# EAGLE design AIOT_02 (EAGLE 9.2.2)
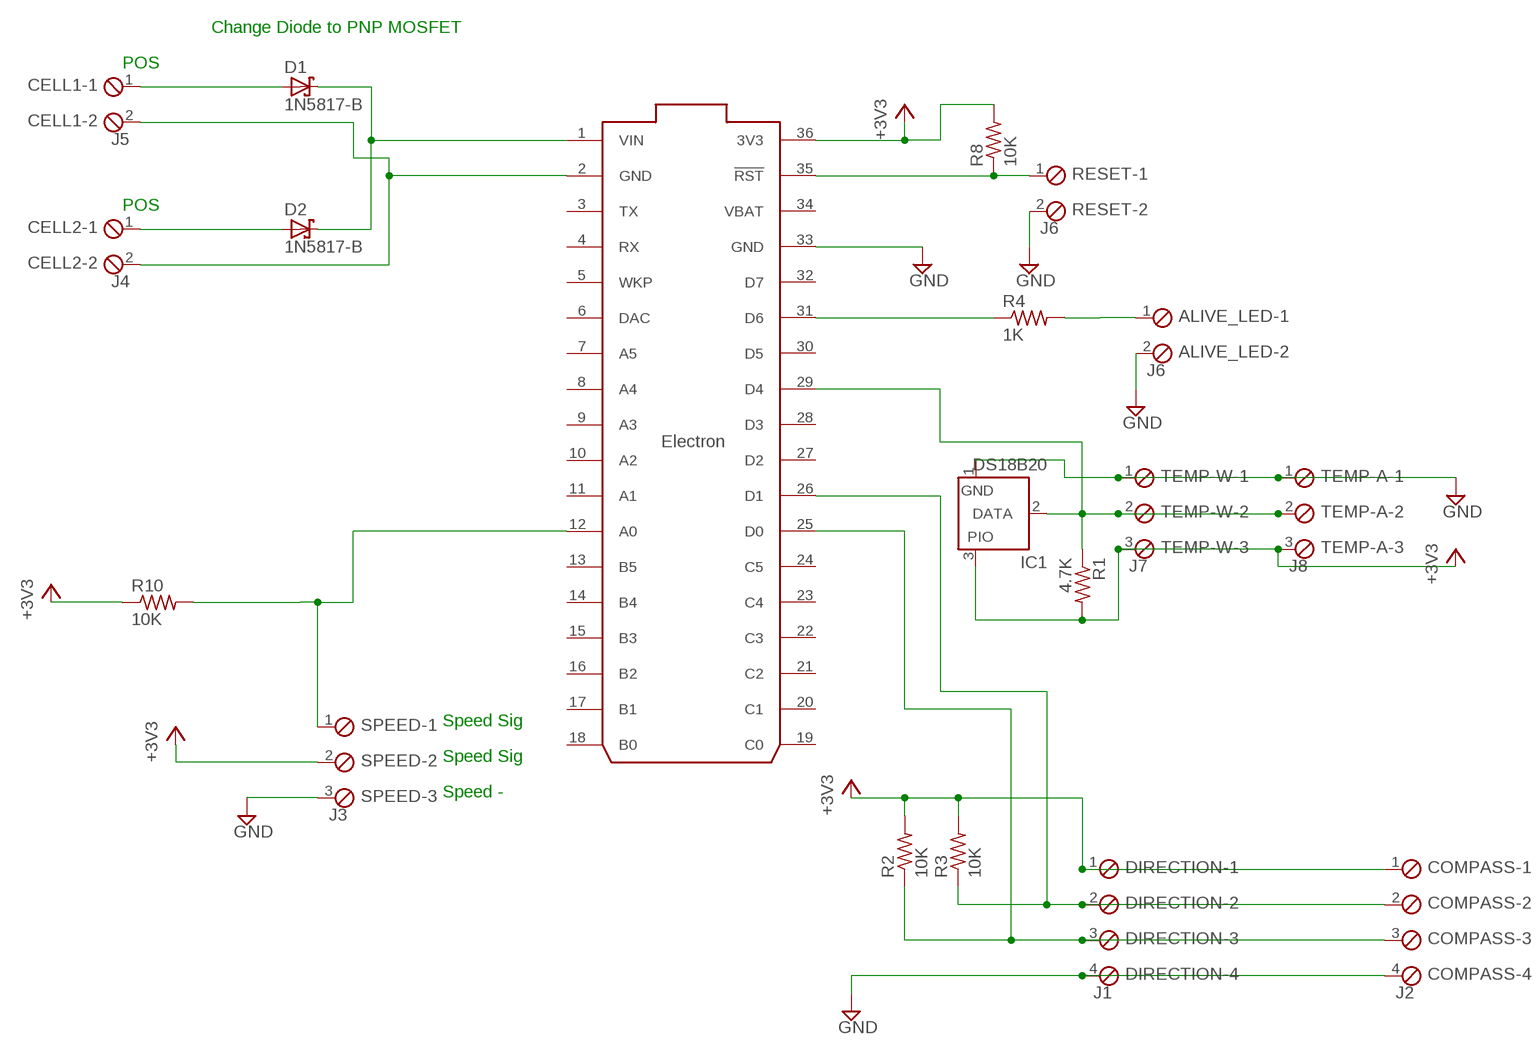
[diagram p0: schematic, sheet 1]

## Parts
ALIVE_LED  J6  MPT2  [2POL254]
CELL1  J5  MPT2  [2POL254]
CELL2  J4  MPT2  [2POL254]
COMPASS  J2  MPT4  [4POL254]
D1  1N5817-B  [DO41-7.6]
D2  1N5817-B  [DO41-7.6]
DIRECTION  J1  MPT4  [4POL254]
IC1  DS18B20  DS2405  [TO92-]
R1  4.7K  R-US_R1210  [R1210]
R2  10K  R-US_R1210  [R1210]
R3  10K  R-US_R1210  [R1210]
R4  1K  R-US_R1210  [R1210]
R8  10K  R-US_R1210  [R1210]
R10  10K  R-US_R1210  [R1210]
RESET  J6  MPT2  [2POL254]
SPEED  J3  MPT3  [3POL254]
TEMP-A  J8  MPT3  [3POL254]
TEMP-W  J7  MPT3  [3POL254]
U$1  ELECTRON_WITH_HEADERS  [ELECTRON]

## Nets
+3V3: COMPASS.1 DIRECTION.1 IC1.3(PIO) R1.2 R2.2 R3.2 R8.2 R10.1 SPEED.2 TEMP-A.3 TEMP-W.3 U$1.36(3V3)
GND: ALIVE_LED.2 CELL1.2 CELL2.2 COMPASS.4 DIRECTION.4 IC1.1(GND) RESET.2 SPEED.3 TEMP-A.1 TEMP-W.1 U$1.2(GND) U$1.33(GND)
N$1: CELL1.1 D1.A
N$2: D1.C D2.C U$1.1(VIN)
N$3: CELL2.1 D2.A
N$5: R10.2 SPEED.1 U$1.12(A0)
N$6: COMPASS.2 DIRECTION.2 R3.1 U$1.26(D1)
N$7: ALIVE_LED.1 R4.2
N$8: COMPASS.3 DIRECTION.3 R2.1 U$1.25(D0)
N$9: IC1.2(DATA) R1.1 TEMP-A.2 TEMP-W.2 U$1.29(D4)
N$10: R8.1 RESET.1 U$1.35(!RST)
N$11: R4.1 U$1.31(D6)
Unconnected: U$1.3(TX) U$1.4(RX) U$1.5(WKP) U$1.6(DAC) U$1.7(A5) U$1.8(A4) U$1.9(A3) U$1.10(A2) U$1.11(A1) U$1.13(B5) U$1.14(B4) U$1.15(B3) U$1.16(B2) U$1.17(B1) U$1.18(B0) U$1.19(C0) U$1.20(C1) U$1.21(C2) U$1.22(C3) U$1.23(C4) U$1.24(C5) U$1.27(D2) U$1.28(D3) U$1.30(D5) U$1.32(D7)

## Notes on the sheet
- Change Diode to PNP MOSFET
- POS
- POS
- Speed Sig
- Speed Sig
- Speed -

## Power pins joined to a net without a drawn wire
VBAT: U$1.34(VBAT)

## Library data of the parts
ALIVE_LED CELL1 CELL2 RESET = con-phoenix-254:MPT2: PHOENIX CONNECTOR
COMPASS DIRECTION = con-phoenix-254:MPT4: PHOENIX CONNECTOR
D1 D2 = diode:1N581*: 1.0A SCHOTTKY BARRIER RECTIFIER Source: http://www.diodes.com/datasheets/ds23001.pdf
IC1 = maxim:DS2405: Addressable Switch DALLAS Semiconductor; MF: DALLAS SEMICONDUCTOR; MPN: DS2405; OC_FARNELL: 1188025; OC_NEWARK: 06F4645
R1-R4 R8 R10 = rcl:R-US_: RESISTOR, American symbol; SPICEPREFIX: R
SPEED TEMP-A TEMP-W = con-phoenix-254:MPT3: PHOENIX CONNECTOR
U$1 = Particle-Devices:ELECTRON: The Particle Electron is a tiny development kit for creating cellular-connected electronics projects and products. It comes with a SIM card (Nano 4FF) and an affordable data plan for low-bandwidth things. Design files : here <https://github.com/particle-iot/electron> Product Page : Datasheet <https://docs.particle.io/datasheets/electron-(cellular)/electron-datasheet/> Github : Particle devices library <https://github.com/particle-iot/hardware-libraries/tree/master/Eagle>

## Board
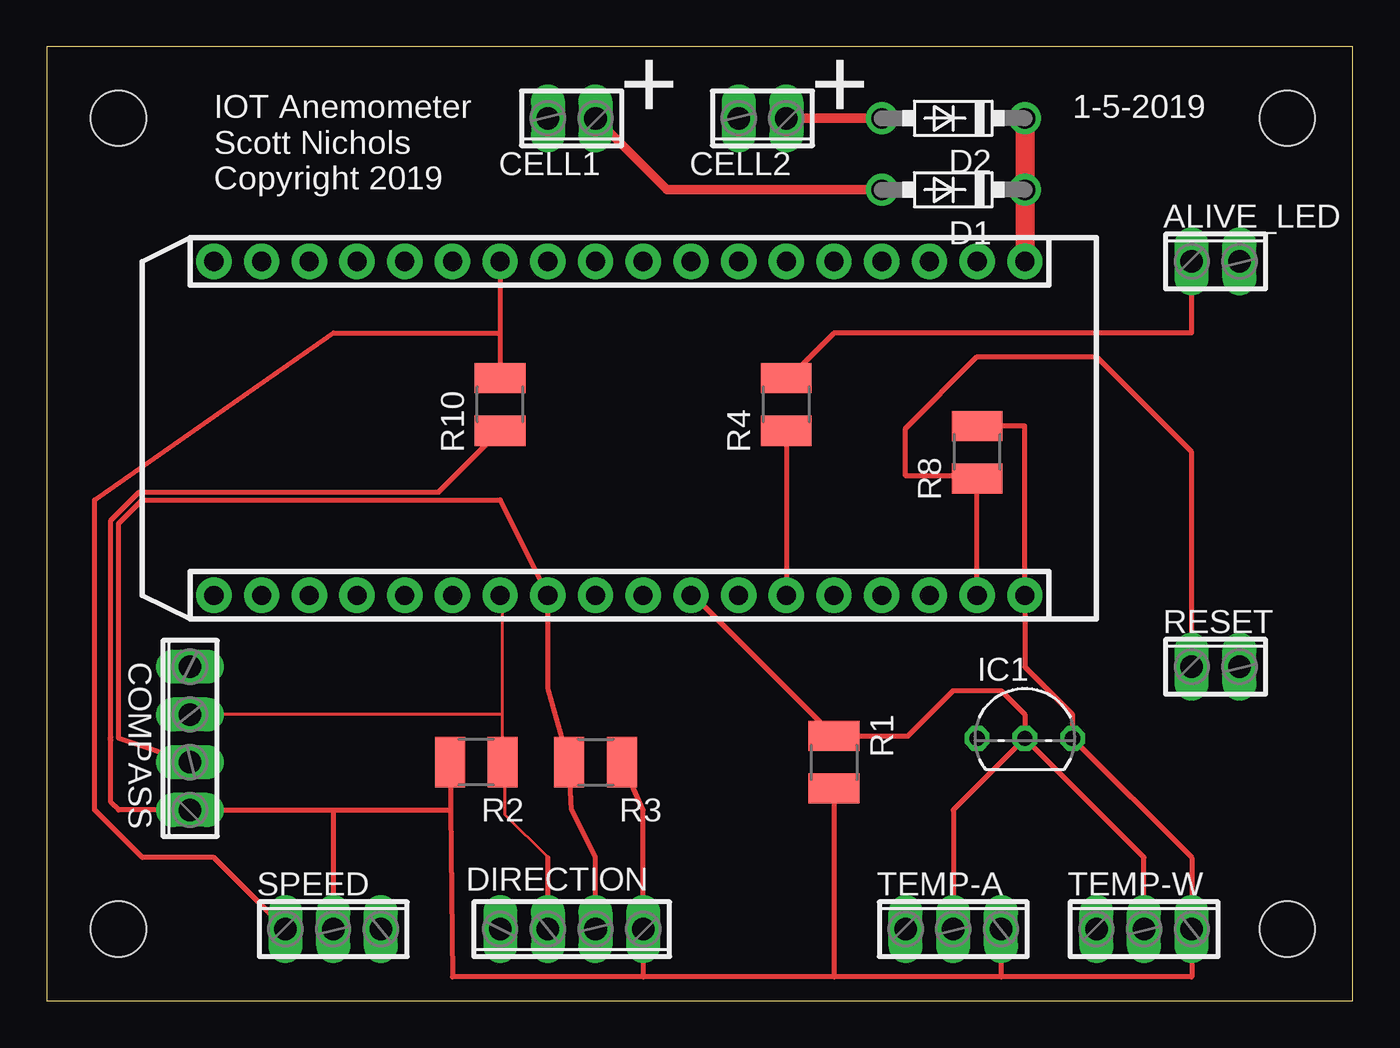
[diagram p1: board, top side]
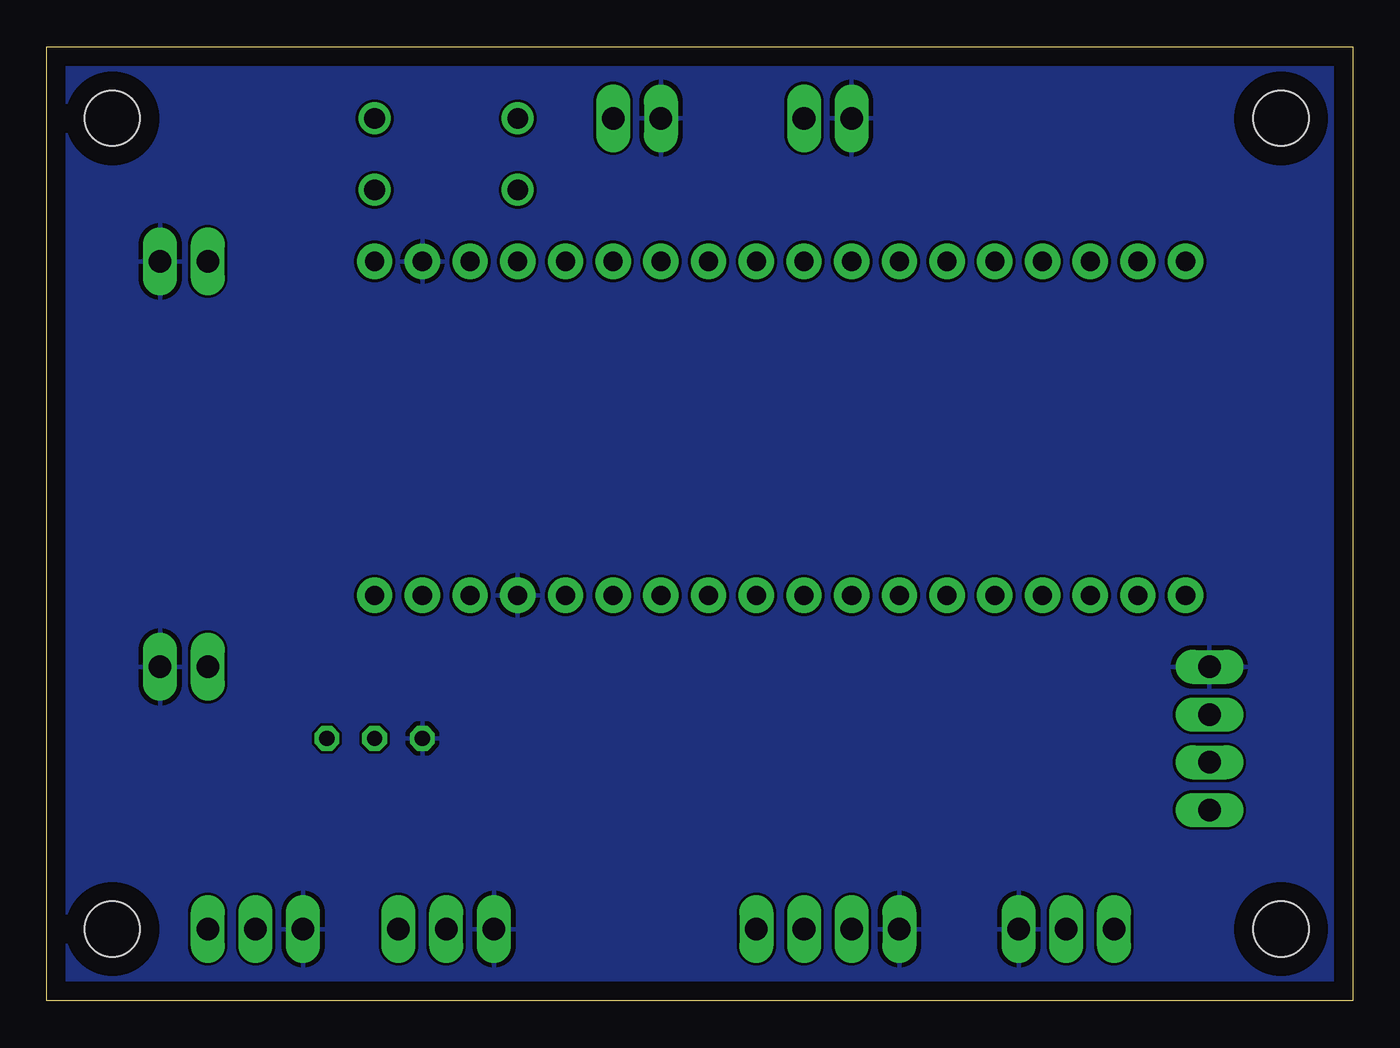
[diagram p2: board, bottom side, seen from below]

Size 69.52 x 50.79 mm. Coordinates in mm from the lower left corner, seen from the top.
Outline: 0,0 69.52,0 69.52,50.79 0,50.79 0,0
Copper layers (1*16): Top 0.035mm / dielectric 1.5mm / Bottom 0.035mm
Design rules "default": minimum track width 6mil, minimum drill 0.35mm, track to track 6mil, track to pad 6mil, pad to pad 6mil, via to via 6mil, smd to smd 6mil, copper to edge 40mil, drill to drill 6mil, minimum pad ring 10mil, minimum via ring 8mil, stop-mask expansion 4mil, vias tented up to drill 0mil, thermal gap 10mil
Holes 2.95 mm at 66.04,46.99 3.81,46.99 3.81,3.81 66.04,3.81

### Footprints (pad centres in the part's own frame; a part is rotated, then mirrored left to right if it is on the bottom)
2POL254 = drill 1.2 long: 1 -1.27,0; 2 1.27,0
4POL254 = drill 1.2 long: 1 -3.81,0; 2 -1.27,0; 3 1.27,0; 4 3.81,0
DO41-7.6 = drill 1.1 pad 1.7: A 3.81,0; C -3.81,0
TO92- = drill 0.813 octagon: 1 -2.54,0; 2 0,0; 3 2.54,0
R1210 = smd 1.6 x 2.7: 1 -1.4,0; 2 1.4,0
3POL254 = drill 1.2 long: 1 -2.54,0; 2 0,0; 3 2.54,0
ELECTRON = drill 1.016 pad 1.88: 1 1.27,46.99; 2 1.27,44.45; 3 1.27,41.91; 4 1.27,39.37; 5 1.27,36.83; 6 1.27,34.29; 7 1.27,31.75; 8 1.27,29.21; 9 1.27,26.67; 10 1.27,24.13; 11 1.27,21.59; 12 1.27,19.05; 13 1.27,16.51; 14 1.27,13.97; 15 1.27,11.43; 16 1.27,8.89; 17 1.27,6.35; 18 1.27,3.81; 19 19.05,3.81; 20 19.05,6.35; 21 19.05,8.89; 22 19.05,11.43; 23 19.05,13.97; 24 19.05,16.51; 25 19.05,19.05; 26 19.05,21.59; 27 19.05,24.13; 28 19.05,26.67; 29 19.05,29.21; 30 19.05,31.75; 31 19.05,34.29; 32 19.05,36.83; 33 19.05,39.37; 34 19.05,41.91; 35 19.05,44.45; 36 19.05,46.99

### Placement (x,y rotation side)
ALIVE_LED  62.23,39.37 0 top
CELL1  27.94,46.99 180 top
CELL2  38.1,46.99 180 top
COMPASS  7.62,13.97 90 top
D1  48.26,43.18 180 top
D2  48.26,46.99 180 top
DIRECTION  27.94,3.81 180 top
IC1  52.07,13.97 0 top
R1  41.91,12.7 270 top
R2  22.86,12.7 180 top
R3  29.21,12.7 0 top
R4  39.37,31.75 90 top
R8  49.53,29.21 90 top
R10  24.13,31.75 90 top
RESET  62.23,17.78 0 top
SPEED  15.24,3.81 0 top
TEMP-A  48.26,3.81 0 top
TEMP-W  58.42,3.81 0 top
U$1  5.08,40.64 270 top

### Tracks (layer width: path | path; a pad name or v marks a point on that pad's centre or on a via)
+3V3
  Top 0.254: 50.8,1.27 60.96,1.27 TEMP-W.3 60.96,7.62 IC1.3 54.61,15.24 52.07,17.78 U$1.36 52.07,30.61 R8.2 | TEMP-A.3 50.8,1.27 | 50.8,1.27 41.91,1.27 | 41.91,1.27 31.75,1.27 | 31.75,1.27 21.59,1.27 21.49,10.16 | R1.2 41.91,1.27 | R2.2 21.49,10.16 | 31.75,1.27 DIRECTION.1 31.75,10.16 R3.2 | 15.24,10.16 COMPASS.1 3.81,10.16 3.4,10.57 3.4,13.87 3.37,13.94 3.4,14.04 3.4,25.57 4.91,27.08 20.86,27.08 R10.1 | 15.24,10.16 21.49,10.16 | 15.24,10.16 SPEED.2
GND
  pour Bottom: 0,50.8 0,0 69.85,0 69.85,50.8
N$1
  Top 0.508: D1.A 33.02,43.18 CELL1.1
N$2
  Top 1.016: U$1.1 D1.C D2.C
N$3
  Top 0.508: D2.A CELL2.1
N$5
  Top 0.254: U$1.12 R10.2 24.13,35.56 15.24,35.56 2.54,26.67 2.54,10.16 5.08,7.62 8.89,7.62 SPEED.1
N$6
  Top 0.254: DIRECTION.2 29.21,7.62 27.94,10.16 R3.1 26.67,16.64 U$1.26 24.13,26.67 5.08,26.67 3.81,25.4 3.81,13.97 COMPASS.2
N$7
  Top 0.254: R4.2 39.5,33.15 41.91,35.56 60.96,35.56 ALIVE_LED.1
N$8
  Top 0.152: 26.67,7.62 24.38,9.91 24.38,12.65 R2.1 24.23,14.02 24.23,15.24 | 24.23,15.24 24.23,21.49 U$1.25 | 24.23,15.24 COMPASS.3
  Top 0.254: DIRECTION.3 26.67,7.62
N$9
  Top 0.254: U$1.29 34.42,21.59 R1.1 45.85,14.1 48.26,16.51 50.8,16.51 52.07,15.24 IC1.2 | IC1.2 48.26,10.16 TEMP-A.2 | TEMP-W.2 58.42,7.62 IC1.2
N$10
  Top 0.254: U$1.35 R8.1 49.4,27.94 45.72,27.94 45.72,30.48 49.53,34.29 55.88,34.29 60.96,29.21 RESET.1
N$11
  Top 0.254: R4.1 U$1.31

### Text on the board
tPlace: + | + | 1-5-2019 | IOT Anemometer / Scott Nichols / Copyright 2019